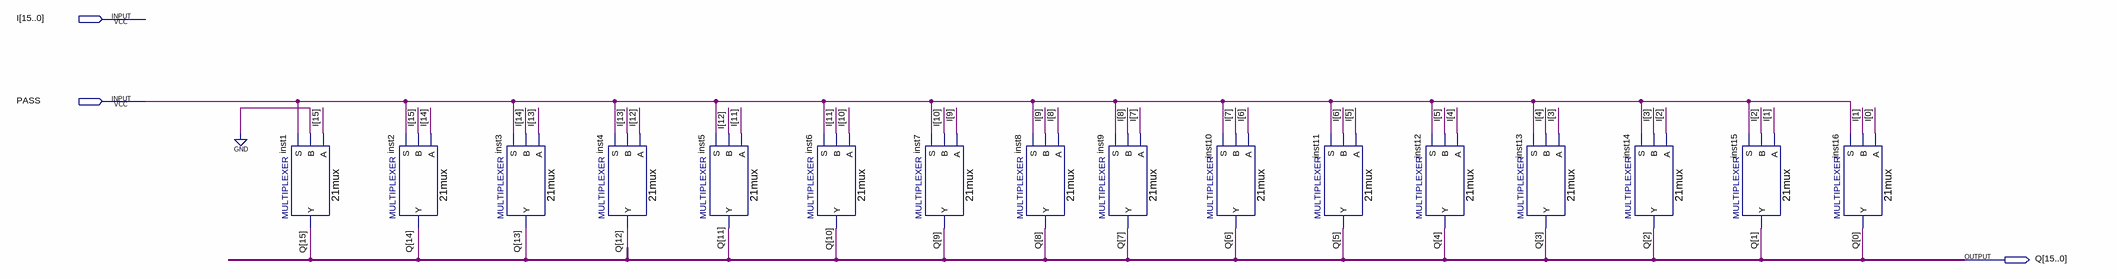
[diagram p0: schematic sheet]
// Quartus schematic shifter_16bit.bdf as structural Verilog: 16 symbols, 3 pins
module shifter_16bit (
  input  [15:0] I,
  input  PASS,
  output [15:0] Q
);

  \21mux  inst1 (.S(PASS), .B(1'b0), .A(I[15]), .Y(Q[15]));
  \21mux  inst2 (.S(PASS), .B(I[15]), .A(I[14]), .Y(Q[14]));
  \21mux  inst3 (.S(PASS), .B(I[14]), .A(I[13]), .Y(Q[13]));
  \21mux  inst4 (.S(PASS), .B(I[13]), .A(I[12]), .Y(Q[12]));
  \21mux  inst5 (.S(PASS), .B(I[12]), .A(I[11]), .Y(Q[11]));
  \21mux  inst6 (.S(PASS), .B(I[11]), .A(I[10]), .Y(Q[10]));
  \21mux  inst7 (.S(PASS), .B(I[10]), .A(I[9]), .Y(Q[9]));
  \21mux  inst8 (.S(PASS), .B(I[9]), .A(I[8]), .Y(Q[8]));
  \21mux  inst9 (.S(PASS), .B(I[8]), .A(I[7]), .Y(Q[7]));
  \21mux  inst10 (.S(PASS), .B(I[7]), .A(I[6]), .Y(Q[6]));
  \21mux  inst11 (.S(PASS), .B(I[6]), .A(I[5]), .Y(Q[5]));
  \21mux  inst12 (.S(PASS), .B(I[5]), .A(I[4]), .Y(Q[4]));
  \21mux  inst13 (.S(PASS), .B(I[4]), .A(I[3]), .Y(Q[3]));
  \21mux  inst14 (.S(PASS), .B(I[3]), .A(I[2]), .Y(Q[2]));
  \21mux  inst15 (.S(PASS), .B(I[2]), .A(I[1]), .Y(Q[1]));
  \21mux  inst16 (.S(PASS), .B(I[1]), .A(I[0]), .Y(Q[0]));
endmodule
